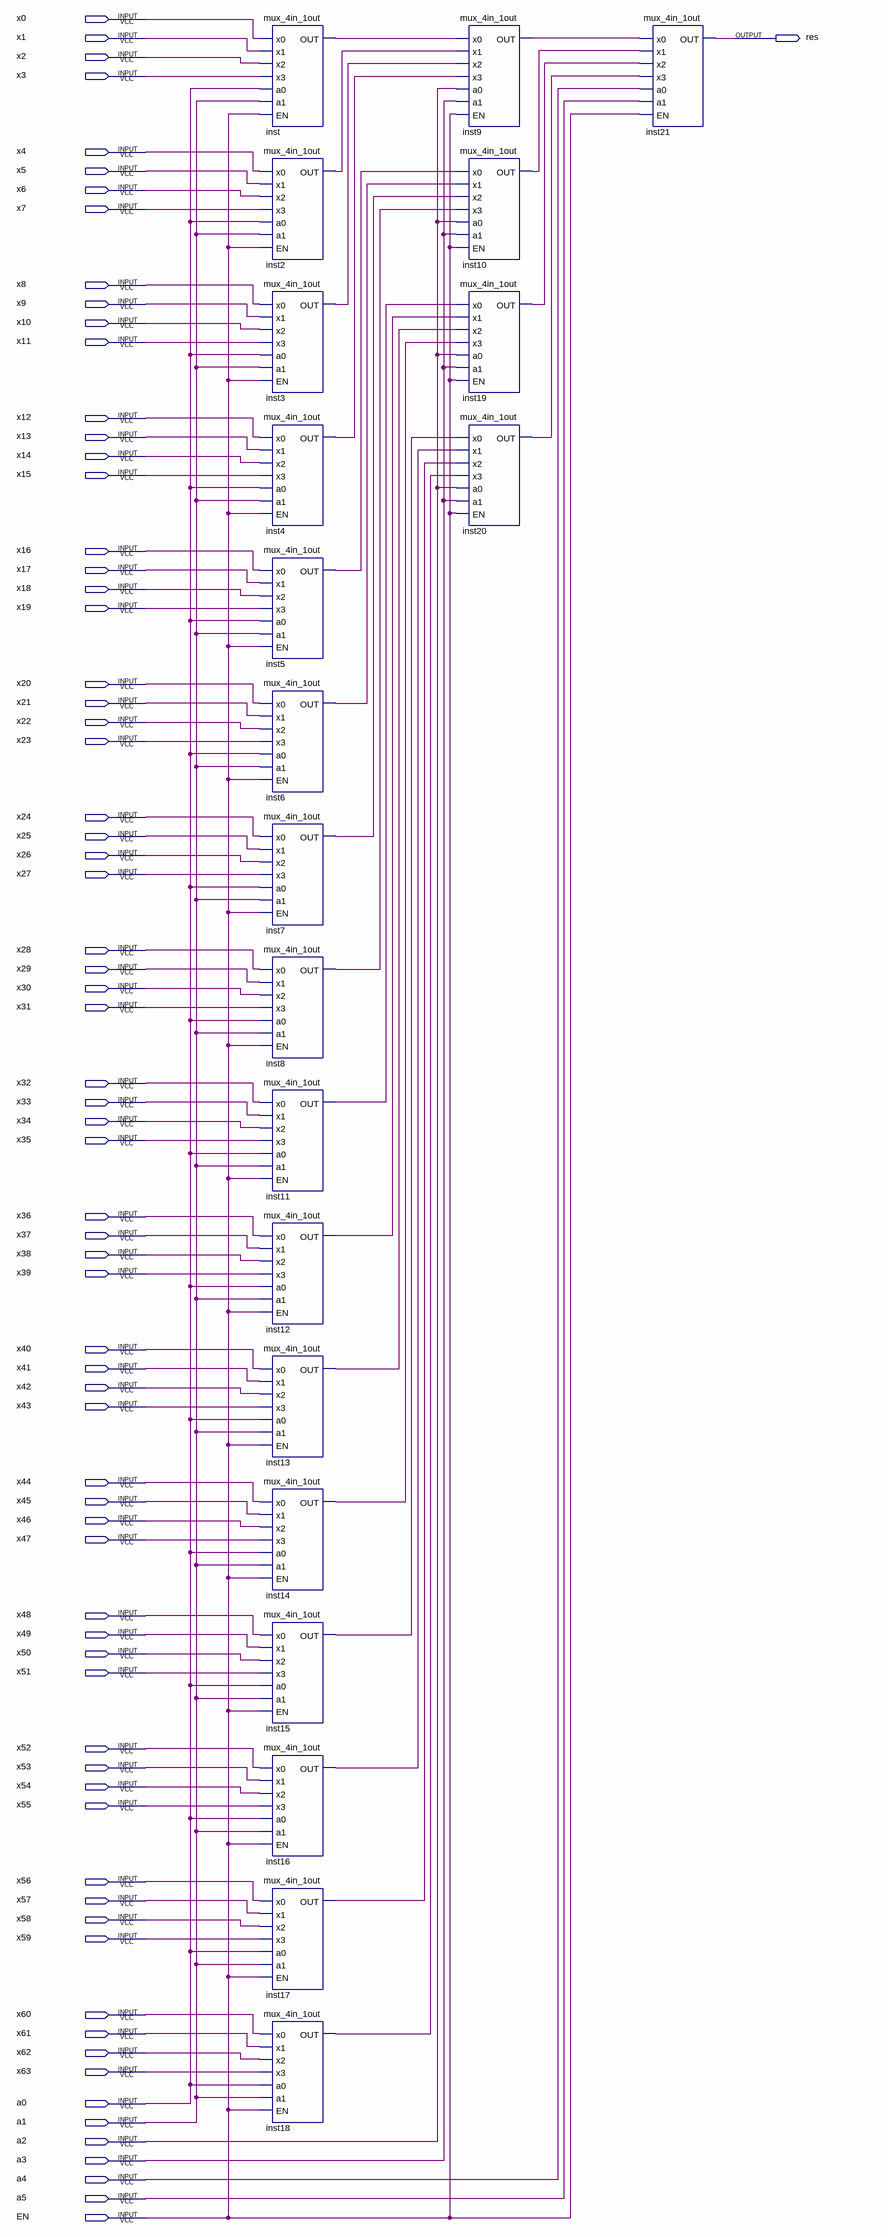
[diagram p0: schematic sheet]
// Quartus schematic mux_64in_1out.bdf as structural Verilog: 21 symbols, 72 pins
module mux_64in_1out (
  input  x0,
  input  x1,
  input  x2,
  input  x3,
  input  x4,
  input  x5,
  input  x6,
  input  x7,
  input  x8,
  input  x9,
  input  x10,
  input  x11,
  input  x12,
  input  x13,
  input  x14,
  input  x15,
  input  x16,
  input  x17,
  input  x18,
  input  x19,
  input  x20,
  input  x21,
  input  x22,
  input  x23,
  input  x24,
  input  x25,
  input  x26,
  input  x27,
  input  x28,
  input  x29,
  input  x30,
  input  x31,
  input  x32,
  input  x33,
  input  x34,
  input  x35,
  input  x36,
  input  x37,
  input  x38,
  input  x39,
  input  x40,
  input  x41,
  input  x42,
  input  x43,
  input  x44,
  input  x45,
  input  x46,
  input  x47,
  input  x48,
  input  x49,
  input  x50,
  input  x51,
  input  x52,
  input  x53,
  input  x54,
  input  x55,
  input  x56,
  input  x57,
  input  x58,
  input  x59,
  input  x60,
  input  x61,
  input  x62,
  input  x63,
  input  a0,
  input  a1,
  input  a2,
  input  a3,
  input  a4,
  input  a5,
  input  EN,
  output res
);

  wire inst2_out, inst3_out, inst4_out, inst5_out, inst6_out, inst7_out, inst8_out, inst9_out, inst10_out,
       inst11_out, inst12_out, inst13_out, inst14_out, inst15_out, inst16_out, inst17_out, inst18_out,
       inst19_out, inst20_out, inst_out;

  mux_4in_1out inst (.x0(x0), .x1(x1), .x2(x2), .x3(x3), .a0(a0), .a1(a1), .EN(EN), .OUT(inst_out));
  mux_4in_1out inst2 (.x0(x4), .x1(x5), .x2(x6), .x3(x7), .a0(a0), .a1(a1), .EN(EN), .OUT(inst2_out));
  mux_4in_1out inst3 (.x0(x8), .x1(x9), .x2(x10), .x3(x11), .a0(a0), .a1(a1), .EN(EN), .OUT(inst3_out));
  mux_4in_1out inst4 (.x0(x12), .x1(x13), .x2(x14), .x3(x15), .a0(a0), .a1(a1), .EN(EN), .OUT(inst4_out));
  mux_4in_1out inst5 (.x0(x16), .x1(x17), .x2(x18), .x3(x19), .a0(a0), .a1(a1), .EN(EN), .OUT(inst5_out));
  mux_4in_1out inst6 (.x0(x20), .x1(x21), .x2(x22), .x3(x23), .a0(a0), .a1(a1), .EN(EN), .OUT(inst6_out));
  mux_4in_1out inst7 (.x0(x24), .x1(x25), .x2(x26), .x3(x27), .a0(a0), .a1(a1), .EN(EN), .OUT(inst7_out));
  mux_4in_1out inst8 (.x0(x28), .x1(x29), .x2(x30), .x3(x31), .a0(a0), .a1(a1), .EN(EN), .OUT(inst8_out));
  mux_4in_1out inst11 (.x0(x32), .x1(x33), .x2(x34), .x3(x35), .a0(a0), .a1(a1), .EN(EN), .OUT(inst11_out));
  mux_4in_1out inst12 (.x0(x36), .x1(x37), .x2(x38), .x3(x39), .a0(a0), .a1(a1), .EN(EN), .OUT(inst12_out));
  mux_4in_1out inst13 (.x0(x40), .x1(x41), .x2(x42), .x3(x43), .a0(a0), .a1(a1), .EN(EN), .OUT(inst13_out));
  mux_4in_1out inst14 (.x0(x44), .x1(x45), .x2(x46), .x3(x47), .a0(a0), .a1(a1), .EN(EN), .OUT(inst14_out));
  mux_4in_1out inst15 (.x0(x48), .x1(x49), .x2(x50), .x3(x51), .a0(a0), .a1(a1), .EN(EN), .OUT(inst15_out));
  mux_4in_1out inst16 (.x0(x52), .x1(x53), .x2(x54), .x3(x55), .a0(a0), .a1(a1), .EN(EN), .OUT(inst16_out));
  mux_4in_1out inst17 (.x0(x56), .x1(x57), .x2(x58), .x3(x59), .a0(a0), .a1(a1), .EN(EN), .OUT(inst17_out));
  mux_4in_1out inst18 (.x0(x60), .x1(x61), .x2(x62), .x3(x63), .a0(a0), .a1(a1), .EN(EN), .OUT(inst18_out));
  mux_4in_1out inst9 (
    .x0(inst_out), .x1(inst2_out), .x2(inst3_out), .x3(inst4_out), .a0(a2), .a1(a3), .EN(EN), .OUT(inst9_out));
  mux_4in_1out inst10 (
    .x0(inst5_out), .x1(inst6_out), .x2(inst7_out), .x3(inst8_out), .a0(a2), .a1(a3), .EN(EN),
    .OUT(inst10_out));
  mux_4in_1out inst19 (
    .x0(inst11_out), .x1(inst12_out), .x2(inst13_out), .x3(inst14_out), .a0(a2), .a1(a3), .EN(EN),
    .OUT(inst19_out));
  mux_4in_1out inst20 (
    .x0(inst15_out), .x1(inst16_out), .x2(inst17_out), .x3(inst18_out), .a0(a2), .a1(a3), .EN(EN),
    .OUT(inst20_out));
  mux_4in_1out inst21 (
    .x0(inst9_out), .x1(inst10_out), .x2(inst19_out), .x3(inst20_out), .a0(a4), .a1(a5), .EN(EN), .OUT(res));
endmodule
